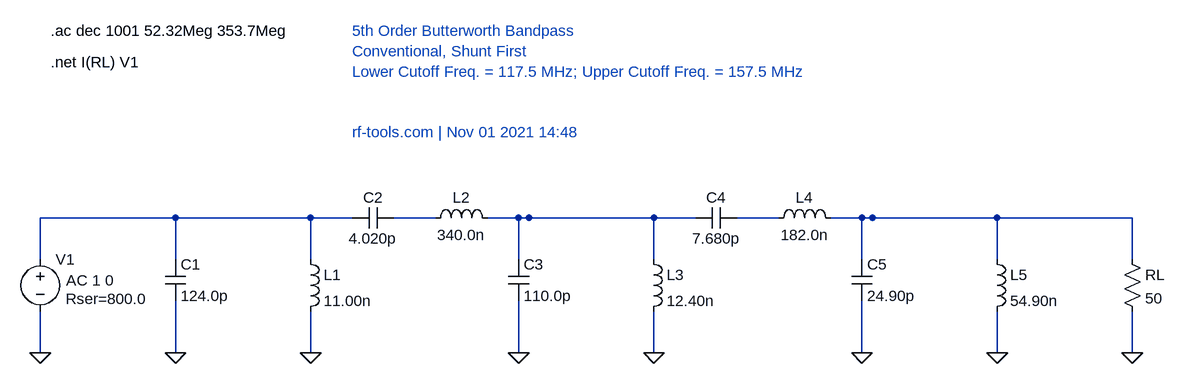
[diagram p0: schematic Butterworth-Bandpass-shunt-first.asc]
Butterworth-Bandpass-shunt-first.asc, the LTspice schematic file:
Version 4
SHEET 1 1200 400
WIRE 0 0 0 64
WIRE 0 144 0 208
WIRE 0 0 208 0
WIRE 208 0 208 64
WIRE 208 128 208 208
WIRE 208 0 416 0
WIRE 416 0 416 64
WIRE 416 144 416 208
WIRE 416 0 480 0
WIRE 544 0 608 0
WIRE 688 0 752 0
WIRE 736 0 736 64
WIRE 736 128 736 208
WIRE 736 0 944 0
WIRE 944 0 944 64
WIRE 944 144 944 208
WIRE 944 0 1008 0
WIRE 1072 0 1136 0
WIRE 1216 0 1280 0
WIRE 1264 0 1264 64
WIRE 1264 128 1264 208
WIRE 1264 0 1472 0
WIRE 1472 0 1472 64
WIRE 1472 144 1472 208
WIRE 1472 0 1680 0
WIRE 1680 0 1680 64
WIRE 1680 144 1680 208
FLAG 0 208 0
FLAG 208 208 0
FLAG 416 208 0
FLAG 736 208 0
FLAG 944 208 0
FLAG 1264 208 0
FLAG 1472 208 0
FLAG 1680 208 0
SYMBOL voltage 0 48 R0
WINDOW 123 40 48 Left 2
WINDOW 39 39 77 Left 2
SYMATTR InstName V1
SYMATTR Value ""
SYMATTR Value2 AC 1 0
SYMATTR SpiceLine Rser=800.0
SYMBOL cap 192 64 R0
SYMATTR InstName C1
SYMATTR Value 124.0p
SYMBOL ind 400 48 R0
SYMATTR InstName L1
SYMATTR Value 11.00n
SYMBOL cap 480 16 R270
SYMATTR InstName C2
SYMATTR Value 4.020p
WINDOW 0 32 32 VTop 2
WINDOW 3 0 32 VBottom 2
SYMBOL ind 592 16 R270
SYMATTR InstName L2
SYMATTR Value 340.0n
WINDOW 0 32 56 VTop 2
WINDOW 3 5 56 VBottom 2
SYMBOL cap 720 64 R0
SYMATTR InstName C3
SYMATTR Value 110.0p
SYMBOL ind 928 48 R0
SYMATTR InstName L3
SYMATTR Value 12.40n
SYMBOL cap 1008 16 R270
SYMATTR InstName C4
SYMATTR Value 7.680p
WINDOW 0 32 32 VTop 2
WINDOW 3 0 32 VBottom 2
SYMBOL ind 1120 16 R270
SYMATTR InstName L4
SYMATTR Value 182.0n
WINDOW 0 32 56 VTop 2
WINDOW 3 5 56 VBottom 2
SYMBOL cap 1248 64 R0
SYMATTR InstName C5
SYMATTR Value 24.90p
SYMBOL ind 1456 48 R0
SYMATTR InstName L5
SYMATTR Value 54.90n
SYMBOL res 1664 48 R0
SYMATTR InstName RL
SYMATTR Value 50
TEXT 16 -288 Left 2 !.ac dec 1001 52.32Meg 353.7Meg
TEXT 16 -240 Left 2 !.net I(RL) V1
TEXT 480 -288 Left 2 ;5th Order Butterworth Bandpass\nConventional, Shunt First\nLower Cutoff Freq. = 117.5 MHz; Upper Cutoff Freq. = 157.5 MHz\n\n\nrf-tools.com | Nov 01 2021 14:48

The netlist it stands for:
* Butterworth-Bandpass-shunt-first.asc
V1 N001 0 AC 1 0 Rser=800.0
C1 N001 0 124.0p
L1 N001 0 11.00n
C2 N001 N002 4.020p
L2 N002 N003 340.0n
C3 N003 0 110.0p
L3 N003 0 12.40n
C4 N003 N004 7.680p
L4 N004 N005 182.0n
C5 N005 0 24.90p
L5 N005 0 54.90n
RL N005 0 50
.ac dec 1001 52.32Meg 353.7Meg
.net I(RL) V1
* 5th Order Butterworth Bandpass
* Conventional, Shunt First
* Lower Cutoff Freq. = 117.5 MHz; Upper Cutoff Freq. = 157.5 MHz
* rf-tools.com | Nov 01 2021 14:48
.backanno
.end